# EAGLE design 6WP_twelite_sensor (EAGLE 9.4.0)
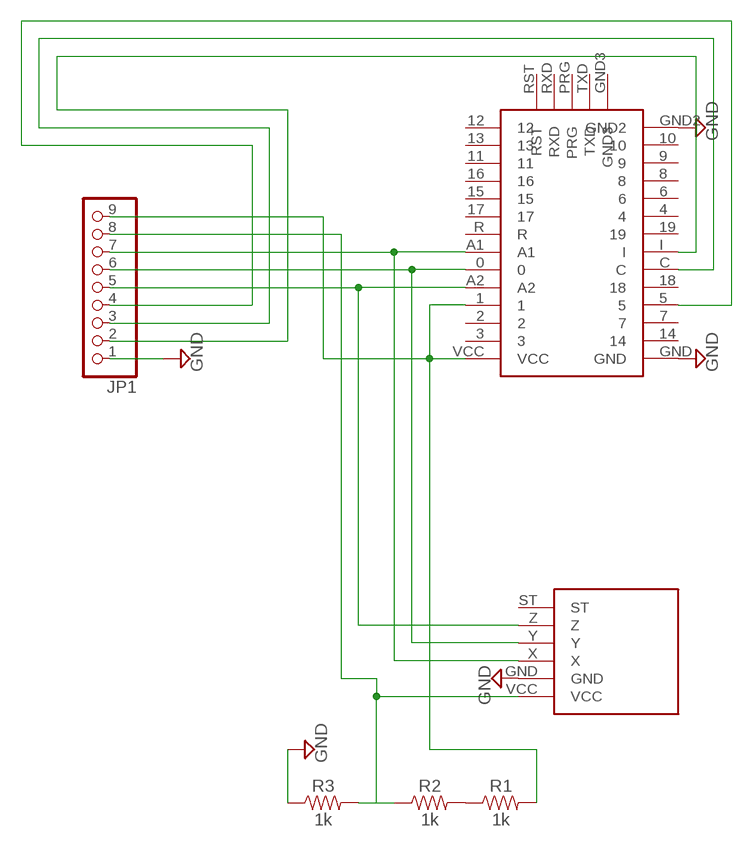
[diagram p0: schematic, sheet 1]

## Parts
A2  ADXL335  [ADXL335]
A4  TWELITEDIP  [TWELITEDIP]
JP1  PINHD-1X9/90  [1X09/90]
R1  1k  1KOHM-HORIZ-1/4W-1%  [AXIAL-0.3]
R2  1k  1KOHM-HORIZ-1/4W-1%  [AXIAL-0.3]
R3  1k  1KOHM-HORIZ-1/4W-1%  [AXIAL-0.3]

## Nets
GND: A2.GND A4.GND A4.GND2 JP1.1 R3.P$1
N$1: R1.P$1 R2.P$2
N$2: A4.C JP1.3
N$3: A4.1 A4.VCC JP1.9 R1.P$2
N$4: A2.Y A4.0 JP1.6
N$6: A2.Z A4.A2 JP1.5
N$7: A2.X A4.A1 JP1.7
N$11: A4.5 JP1.4
N$13: A4.I JP1.2
N$20: A2.VCC JP1.8 R2.P$1 R3.P$2
Unconnected: A2.ST A4.2 A4.3 A4.4 A4.6 A4.7 A4.8 A4.9 A4.10 A4.11 A4.12 A4.13 A4.14 A4.15 A4.16 A4.17 A4.18 A4.19 A4.GND3 A4.PRG A4.R A4.RST A4.RXD A4.TXD

## Library data of the parts
A2 = ADXL335:ADXL335
A4 = Twelite Dip:TWELITEDIP
JP1 = pinhead:PINHD-1X9: PIN HEADER
R1-R3 = SparkFun-Resistors:1KOHM: 1kΩ resistor A resistor is a passive two-terminal electrical component that implements electrical resistance as a circuit element. Resistors act to reduce current flow, and, at the same time, act to lower voltage levels within circuits. - Wikipedia; PROD_ID: RES-12182

## Board
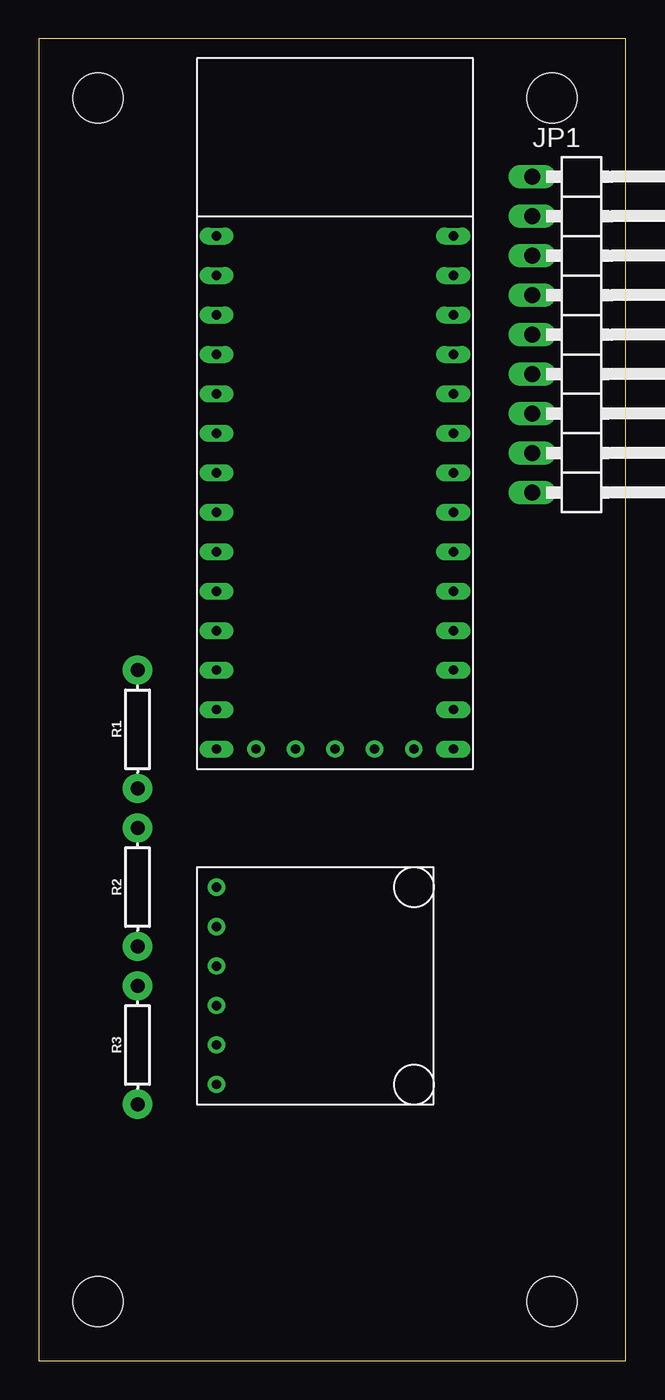
[diagram p1: board, top side]
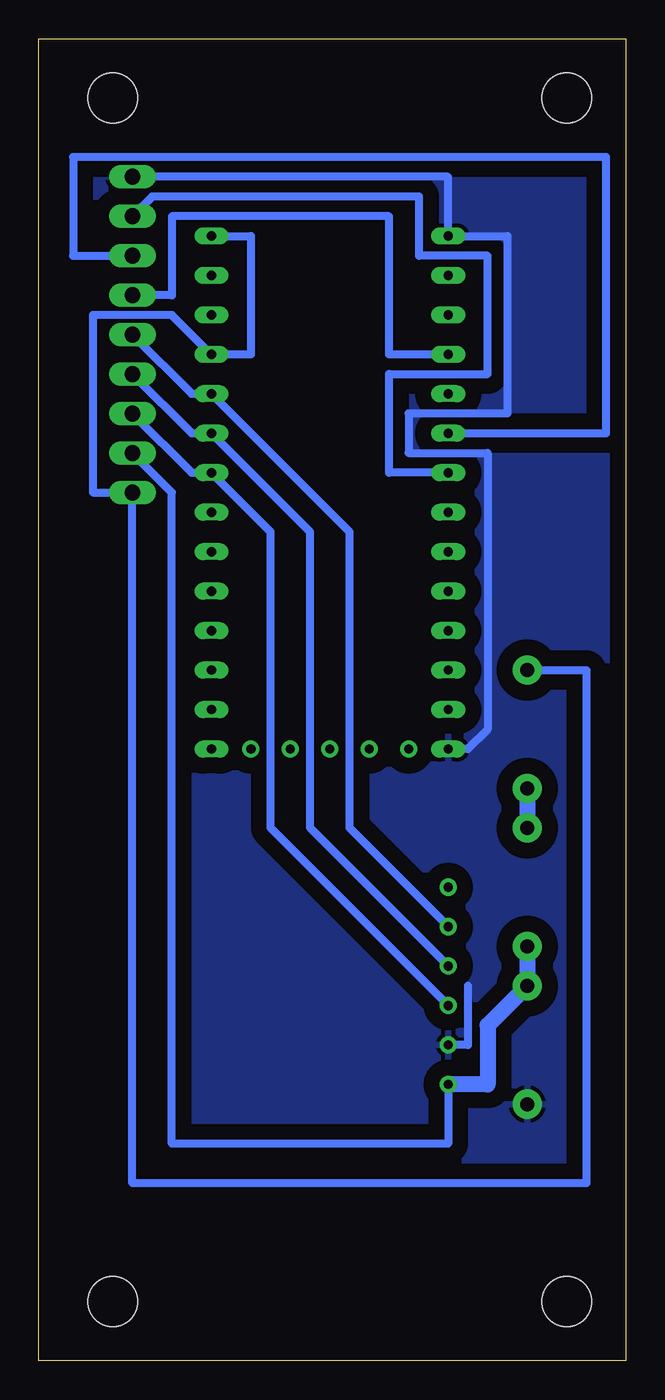
[diagram p2: board, bottom side, seen from below]

Size 37.77 x 85.08 mm. Coordinates in mm from the lower left corner, seen from the top.
Outline: 0,0 37.77,0 37.77,85.08 0,85.08 0,0
Copper layers (1*16): Top 0.035mm / dielectric 1.5mm / Bottom 0.035mm
Design rules "default": minimum track width 6mil, minimum drill 0.35mm, track to track 6mil, track to pad 6mil, pad to pad 6mil, via to via 6mil, smd to smd 6mil, copper to edge 40mil, drill to drill 6mil, minimum pad ring 10mil, minimum via ring 8mil, stop-mask expansion 4mil, vias tented up to drill 0mil, thermal gap 10mil
Holes 3.2 mm at 3.81,81.28 3.81,3.81 33.02,81.28 33.02,3.81

### Footprints (pad centres in the part's own frame; a part is rotated, then mirrored left to right if it is on the bottom)
ADXL335 = drill 0.6: GND -6.35,-3.81; ST -6.35,6.35; VCC -6.35,-6.35; X -6.35,-1.27; Y -6.35,1.27; Z -6.35,3.81
TWELITEDIP = drill 0.6 long: 0 7.62,3.81; 1 7.62,8.89; 2 7.62,11.43; 3 7.62,13.97; 4 -7.62,-3.81; 5 -7.62,8.89; 6 -7.62,-6.35; 7 -7.62,11.43; 8 -7.62,-8.89; 9 -7.62,-11.43; 10 -7.62,-13.97; 11 7.62,-11.43; 12 7.62,-16.51; 13 7.62,-13.97; 14 -7.62,13.97; 15 7.62,-6.35; 16 7.62,-8.89; 17 7.62,-3.81; 18 -7.62,6.35; 19 -7.62,-1.27; A1 7.62,1.27; A2 7.62,6.35; C -7.62,3.81; GND -7.62,16.51; GND2 -7.62,-16.51; I -7.62,1.27; R 7.62,-1.27; VCC 7.62,16.51 | drill 0.6: GND3 -5.08,-16.51; PRG 0,-16.51; RST 5.08,-16.51; RXD 2.54,-16.51; TXD -2.54,-16.51
1X09/90 = drill 1.016 long: 1 -10.16,-3.81; 2 -7.62,-3.81; 3 -5.08,-3.81; 4 -2.54,-3.81; 5 0,-3.81; 6 2.54,-3.81; 7 5.08,-3.81; 8 7.62,-3.81; 9 10.16,-3.81
AXIAL-0.3 = drill 0.9 pad 1.88: P$1 -3.81,0; P$2 3.81,0

### Placement (x,y rotation side)
A2  17.78,24.13 0 top
A4  19.05,55.88 0 top
JP1  35.56,66.04 270 top
R1  6.35,40.64 90 top
R2  6.35,30.48 90 top
R3  6.35,20.32 90 top

### Tracks (layer width: path | path; a pad name or v marks a point on that pad's centre or on a via)
GND
  Bottom 0.508: A2.GND 10.16,20.32 10.16,24.13 | JP1.1 11.43,76.2 A4.GND 7.62,72.39 7.62,60.96 13.97,60.96 13.97,58.42 8.89,58.42 8.89,40.64 10.16,39.37 A4.GND2
  pour Bottom (isolate 1.016): 0,85.09 38.1,85.09 38.1,0 0,0
N$1
  Bottom 1.016: R1.P$1 R2.P$2
N$2
  Bottom 0.508: A4.C 1.27,59.69 1.27,77.47 35.56,77.47 35.56,71.12 JP1.3
N$3
  Bottom 0.508: A4.VCC 24.13,72.39 24.13,64.77 A4.1 29.21,67.31 34.29,67.31 34.29,55.88 JP1.9 31.75,11.43 2.54,11.43 2.54,44.45 R1.P$2
N$4
  Bottom 0.508: JP1.6 27.94,59.69 A4.0 20.32,53.34 20.32,34.29 A2.Y
N$6
  Bottom 0.508: JP1.5 27.94,62.23 A4.A2 17.78,53.34 17.78,34.29 A2.Z
N$7
  Bottom 0.508: JP1.7 27.94,57.15 A4.A1 22.86,53.34 22.86,34.29 A2.X
N$11
  Bottom 0.508: A4.5 15.24,64.77 15.24,73.66 29.21,73.66 29.21,68.58 JP1.4
N$13
  Bottom 0.508: A4.I 15.24,57.15 15.24,63.5 8.89,63.5 8.89,71.12 13.31,71.12 13.31,74.93 30.48,74.93 JP1.2
N$20
  Bottom 0.508: A2.VCC 11.43,13.97 29.21,13.97 29.21,55.88 JP1.8
  Bottom 1.016: R2.P$1 R3.P$2 8.89,21.59 8.89,17.78 A2.VCC